# Altium project TemperatureController.PrjPcb (part 4 of 4)

## Sheet vioutchn7.SchDoc: VIOUTCHN1
size A4 portrait; Organization: 合肥弗雷电子; Address1: 玉兰大道14号D栋3楼; Address2: 肥西县桃花镇; Address3: 合肥市; Address4: 安徽省
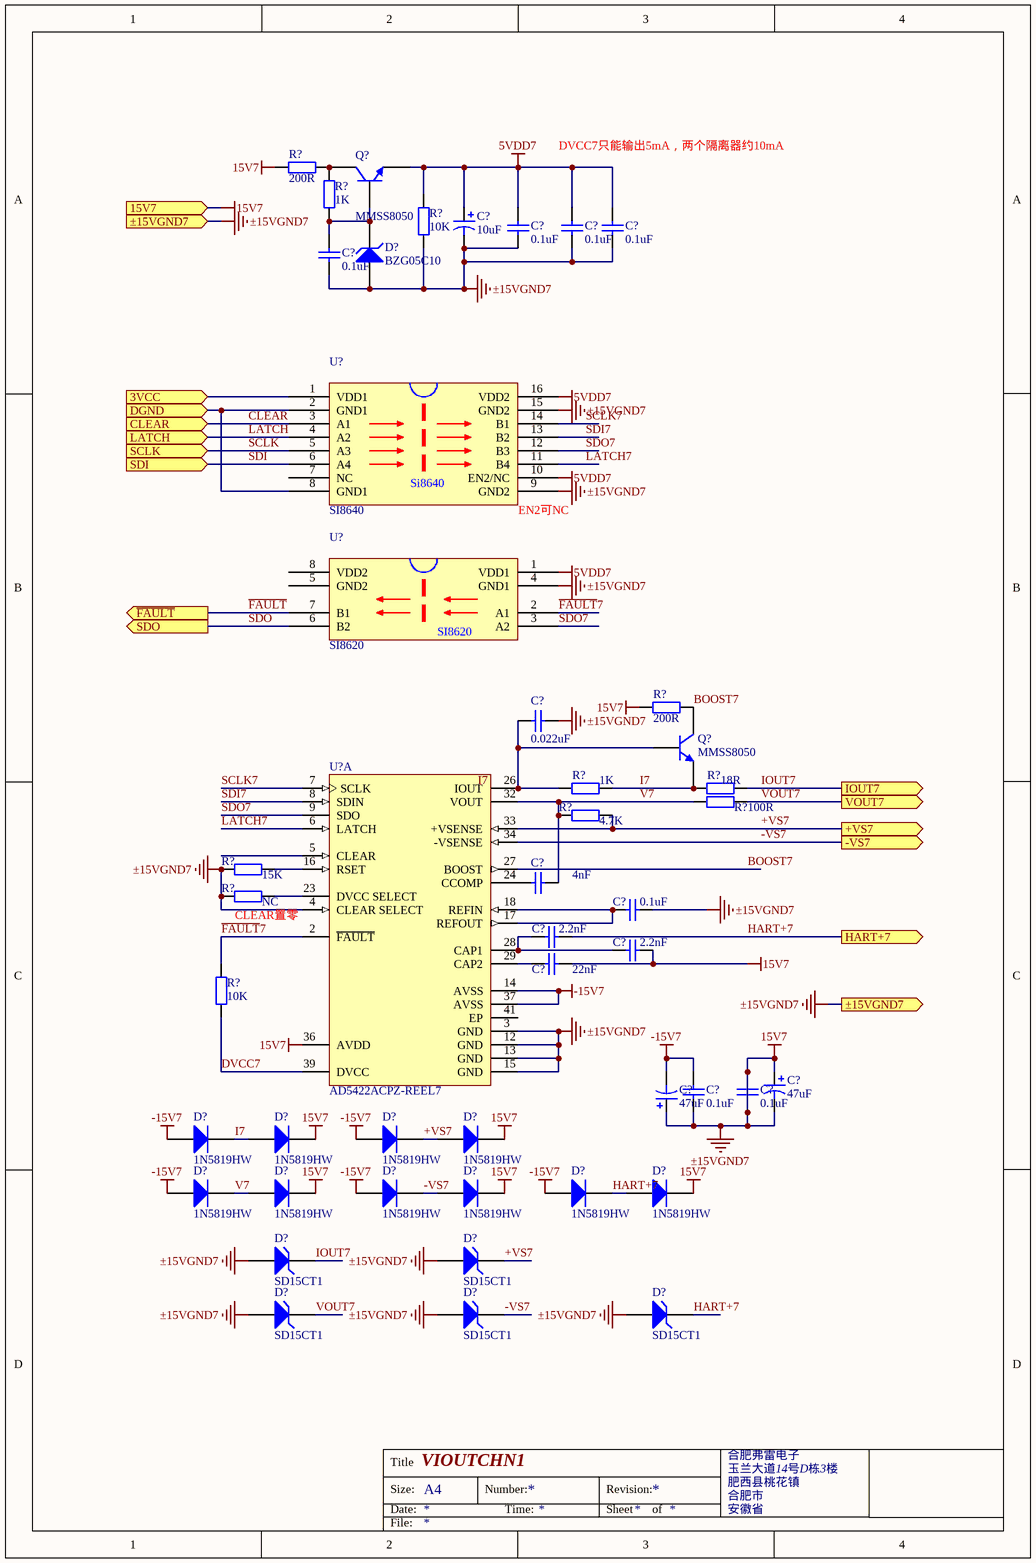
[diagram p13: vioutchn7.SchDoc]

### Parts
(Parts that share a designator on the sheet are numbered #1, #2 ... from top to bottom, then left to right.)
C?#131  value 10uF  [CB]  (hidden comment: T494B106M006AHAUTO)
C?#132  value 0.1uF  [0805c]  (hidden comment: CC0805MRX7R9BB104)
C?#133  value 0.1uF  [0805c]  (hidden comment: CC0805MRX7R9BB104)
C?#134  value 0.1uF  [0805c]  (hidden comment: CC0805MRX7R9BB104)
C?#135  value 0.1uF  [0805c]  (hidden comment: CC0805MRX7R9BB104)
C?#136  value 0.022uF  [0805c]  (hidden comment: CC0805MRX7R9BB103)
C?#137  value 4nF  [0805c]
C?#138  value 0.1uF  [0805c]  (hidden comment: CC0805MRX7R9BB104)
C?#139  value 2.2nF  [0805c]
C?#140  value 2.2nF  [0805c]
C?#141  value 22nF  [0805c]
C?#142  value 0.1uF  [0805c]  (hidden comment: CC0805MRX7R9BB104)
C?#143  value 0.1uF  [0805c]  (hidden comment: CC0805MRX7R9BB104)
C?#144  value 47uF  [CB]  (hidden comment: T494B476K025ATAUTO)
C?#145  value 47uF  [CB]  (hidden comment: T494B476K025ATAUTO)
D?#113  BZG05C10  [DO214]
D?#114  1N5819HW  [sod123]
D?#115  1N5819HW  [sod123]
D?#116  1N5819HW  [sod123]
D?#117  1N5819HW  [sod123]
D?#118  1N5819HW  [sod123]
D?#119  1N5819HW  [sod123]
D?#120  1N5819HW  [sod123]
D?#121  1N5819HW  [sod123]
D?#122  1N5819HW  [sod123]
D?#123  1N5819HW  [sod123]
D?#124  SD15CT1  [sod323]
D?#125  SD15CT1  [sod323]
D?#126  SD15CT1  [sod323]
D?#127  SD15CT1  [sod323]
D?#128  SD15CT1  [sod323]
Q?#15  MMSS8050  [SOT-23-BJT]
Q?#16  MMSS8050  [SOT-23-BJT]
R?#77  value 200R  [0805R]
R?#78  value 1K  [0805R]  (hidden comment: RC0805JR-071KL)
R?#79  value 10K  [0805R]  (hidden comment: RC0805JR-0710KL)
R?#80  value 200R  [0805R]
R?#81  value 1K  [0805R]  (hidden comment: RC0805JR-071KL)
R?#82  value 18R  [0805R]
R?#83  value 100R  [0805R]
R?#84  value 4.7K  [0805R]
R?#85  value 15K  [0805R]  (hidden comment: E192)
R?#86  value NC  [0805R]  (hidden comment: E192)
R?#87  value 10K  [0805R]  (hidden comment: RC0805JR-0710KL)
U?#33  SI8640
U?#34  SI8620
U?#35  AD5422ACPZ-REEL7  [CP-40-1_N]  (part A of 2)

### Ports
3VCC (in), 15V7 (in), +VS7 (out), -VS7 (out), CLEAR (in), DGND (in), HART+7 (out), IOUT7 (out), LATCH (in), SCLK (in), SDI (in), SDO (out), VOUT7 (out), ~{FAULT} (out), ±15VGND7 (in), ±15VGND7 (out)

### Nets
5VDD7: C?#131.1 C?#132.2 C?#133.2 C?#134.2 Q?#15.3(E) R?#79.1 U?#33.10(EN2/NC) U?#33.16(VDD2) U?#34.1(VDD1)
15V7: C?#131.2 C?#132.1 C?#133.1 C?#134.1 C?#135.2 C?#136.1 C?#138.2 C?#140.1 C?#141.1 C?#142.2 C?#143.1 C?#143.2 C?#144.1 C?#144.2 C?#145.1 D?#113.1(A) D?#115.2(K) D?#117.2(K) D?#119.2(K) D?#121.2(K) D?#123.2(K) D?#124.1(A) D?#125.1(A) D?#126.1(A) D?#127.1(A) D?#128.1(A) R?#77.2 R?#79.2 R?#80.2 R?#85.1 R?#86.1 U?#33.9(GND2) U?#33.15(GND2) U?#34.4(GND1) U?#35.3(GND) U?#35.4(CLEAR_SELECT) U?#35.12(GND) U?#35.13(GND) U?#35.15(GND) U?#35.36(AVDD) ; port 15V7, port ±15VGND7  [also labelled ±15VGND7]
-15V7: C?#142.1 C?#145.2 D?#114.1(A) D?#116.1(A) D?#118.1(A) D?#120.1(A) D?#122.1(A) U?#35.14(AVSS) U?#35.37(AVSS)
+VS7: D?#116.2(K) D?#117.1(A) D?#125.2(K) R?#84.2 U?#35.33(+VSENSE) ; port +VS7
-VS7: D?#120.2(K) D?#121.1(A) D?#127.2(K) U?#35.34(-VSENSE) ; port -VS7
BOOST7: Q?#16.1(C) R?#80.1 U?#35.27(BOOST)
CLEAR: U?#33.3(A1) ; port CLEAR
DVCC7: R?#87.2 U?#35.39(DVCC)
~{FAULT}: U?#34.7(B1) ; port ~{FAULT}
~{FAULT}7: R?#87.1 U?#34.2(A1) U?#35.2(~{FAULT})
HART+7: C?#139.1 D?#122.2(K) D?#123.1(A) D?#128.2(K) ; port HART+7
I7: D?#114.2(K) D?#115.1(A) Q?#16.3(E) R?#81.2 R?#82.1
IOUT7: D?#124.2(K) R?#82.2 ; port IOUT7
LATCH: U?#33.4(A2) ; port LATCH
LATCH7: U?#33.11(B4) U?#35.6(LATCH)
SCLK: U?#33.5(A3) ; port SCLK
SCLK7: U?#33.14(B1) U?#35.7(SCLK)
SDI: U?#33.6(A4) ; port SDI
SDI7: U?#33.13(B2) U?#35.8(SDIN)
SDO: U?#34.6(B2) ; port SDO
SDO7: U?#33.12(B3) U?#34.3(A2) U?#35.9(SDO)
V7: C?#137.2 D?#118.2(K) D?#119.1(A) R?#83.1 R?#84.1 U?#35.32(VOUT)
VOUT7: D?#126.2(K) R?#83.2 ; port VOUT7
NetC?#135_1: C?#135.1 D?#113.2(K) Q?#15.2(B) R?#78.1
NetC?#136_2: C?#136.2 Q?#16.2(B) R?#81.1 U?#35.26(IOUT)
NetC?#137_1: C?#137.1 U?#35.24(CCOMP)
NetC?#138_1: C?#138.1 U?#35.17(REFOUT) U?#35.18(REFIN)
NetC?#139_2: C?#139.2 C?#140.2 U?#35.28(CAP1)
NetC?#141_2: C?#141.2 U?#35.29(CAP2)
NetQ?#15_1: Q?#15.1(C) R?#77.1 R?#78.2
NetR?#85_2: R?#85.2 U?#35.16(RSET)
NetR?#86_2: R?#86.2 U?#35.23(DVCC_SELECT)
NetU?#33_1: U?#33.1(VDD1) ; port 3VCC
NetU?#33_2: U?#33.2(GND1) U?#33.8(GND1) ; port DGND

Not connected (* = marked no-connect by the designer): U?#33 7(NC); U?#34 5(GND2) 8(VDD2); U?#35 5(CLEAR) 41(EP)

### Notes on the sheet
- DVCC7只能输出5mA，两个隔离器约10mA
- (near U?#33) EN2可NC
- (near R?#86) CLEAR置零
- Labels drawn without touching a wire or pin: I7
- Title
- Size:
- Date:
- A4
- Number:
- Time:
- Revision:
- Sheet
- of
- File:
- (in symbol SI8640) Si8640

### Library data of the parts
C?#131 C?#144 C?#145 = Cap Pol1: Polarized Capacitor (Radial); Published: 8-Jun-2000; LatestRevisionDate: 17-Jul-2002; LatestRevisionNote: Re-released for DXP Platform.; PackageReference: RB7.6-15; Publisher: Altium Limited; PackageDescription: Polarized Capacitor (Radial); 2 Leads
C?#132-C?#143 = Cap: Capacitor; Published: 8-Jun-2000; LatestRevisionDate: 17-Jul-2002; LatestRevisionNote: Re-released for DXP Platform.; PackageReference: RAD-0.3; Publisher: Altium Limited; PackageDescription: Radial Cap, Thru-Hole; 2 Leads; 0.3 in Pin Spacing
D?#113 = BZG05C10: Silicon Zener Diode (3W); Published: 8-Jun-2000; LatestRevisionDate: 17-Jul-2002; LatestRevisionNote: Re-released for DXP Platform.; DatasheetDocument: 1-Apr-1999; PackageDocument: Apr-1999; PackageReference: DO214; Publisher: Altium Limited; ComponentLink1Description: Manufacturer Link; ComponentLink1URL: http://www.vishay.com/; ComponentLink2Description: Datasheet; ComponentLink2URL: http://www.vishay.com/docs/85595/85595.pdf
D?#114-D?#123 = Diode: Default Diode; Published: 8-Jun-2000; LatestRevisionDate: 17-Jul-2002; LatestRevisionNote: Re-released for DXP Platform.; PackageVersion: Sep-1996; PackageReference: SMC; Publisher: Altium Limited; PackageDescription: DO-214-AB/SMC; 2 C-Bend Leads; Body 7.9 x 5.9 mm, inc. leads (LxW); Code_JEDEC: DO-214-AB
D?#124-D?#128 = D Zener: Zener Diode; Published: 8-Jun-2000; LatestRevisionDate: 17-Jul-2002; LatestRevisionNote: Re-released for DXP Platform.; PackageReference: DIODE-0.7; Publisher: Altium Limited; PackageDescription: Diode, Thru-Hole; 2 Leads; 0.7 in Pin Spacing
Q?#15 Q?#16 = NPN: NPN Bipolar Transistor; Published: 8-Jun-2000; LatestRevisionDate: 17-Jul-2002; LatestRevisionNote: Re-released for DXP Platform.; PackageReference: TO-226-AA; Publisher: Altium Limited; PackageDescription: TO, Flat Index; 3 In-Line, Axial Leads; Body Dia. 4.8mm; Leads 0.55 x 0.51 mm (max); Code_JEDEC: TO-226-AA
R?#77-R?#87 = Res2: Resistor; Published: 8-Jun-2000; LatestRevisionDate: 17-Jul-2002; LatestRevisionNote: Re-released for DXP Platform.; PackageReference: AXIAL-0.4; Publisher: Altium Limited; PackageDescription: Axial Device, Thru-Hole; 2 Leads; 0.4 in Pin Spacing
U?#35 = AD5422ACPZ-REEL7: as U?#14 on sheet viout; DatasheetVersion: Rev.E; PackageVersion: Oct-2006; PackageReference: CP-40-1; PackageDescription: 40-Pin Lead Frame Chip Scale Package [LFCSP_VQ] Very Thin Quad; Supplier 1: Digi-Key; Supplier Part Number 1: AD5422ACPZ-REEL7TR-ND; Supplier 2: Digi-Key; Supplier Part Number 2: AD5422ACPZ-REEL7CT-ND; Supplier 3: Digi-Key; Supplier Part Number 3: AD5422ACPZ-REEL7DKR-ND; Supplier 4: Mouser; Supplier Part Number 4: 584-AD5422ACPZ-R7; Packing: Reel; RoHS: Y; Mounting Technology: Surface Mount; Code_JEDEC: MO-220-VJJD-2; PartNumber: AD5422ACPZ-REEL7; ComponentLink1Description: Manufacturer URL; ComponentLink1URL: http://www.analog.com/en/index.html; ComponentLink2Description: Datasheet; ComponentLink2URL: http://www.analog.com/static/imported-files/data_sheets/AD5412_5422.pdf; ComponentLink3Description: Package Specification; ComponentLink3URL: http://www.analog.com/static/imported-files/packages/PKG_PDF/LFCSP(CP)/CP_40_1.pdf; ComponentLink4Description: Product URL; ComponentLink4URL: http://www.analog.com/en/digital-to-analog-converters/da-converters/ad5422/products/product.html; ComponentLink5Description: Reference Design URL; ComponentLink5URL: http://www.analog.com/en/digital-to-analog-converters/da-converters/ad5422/products/product.html#prod_cross_sell

## Sheet vioutchn8.SchDoc: VIOUTCHN8
size A4 portrait; Organization: 合肥弗雷电子; Address1: 玉兰大道14号D栋3楼; Address2: 肥西县桃花镇; Address3: 合肥市; Address4: 安徽省
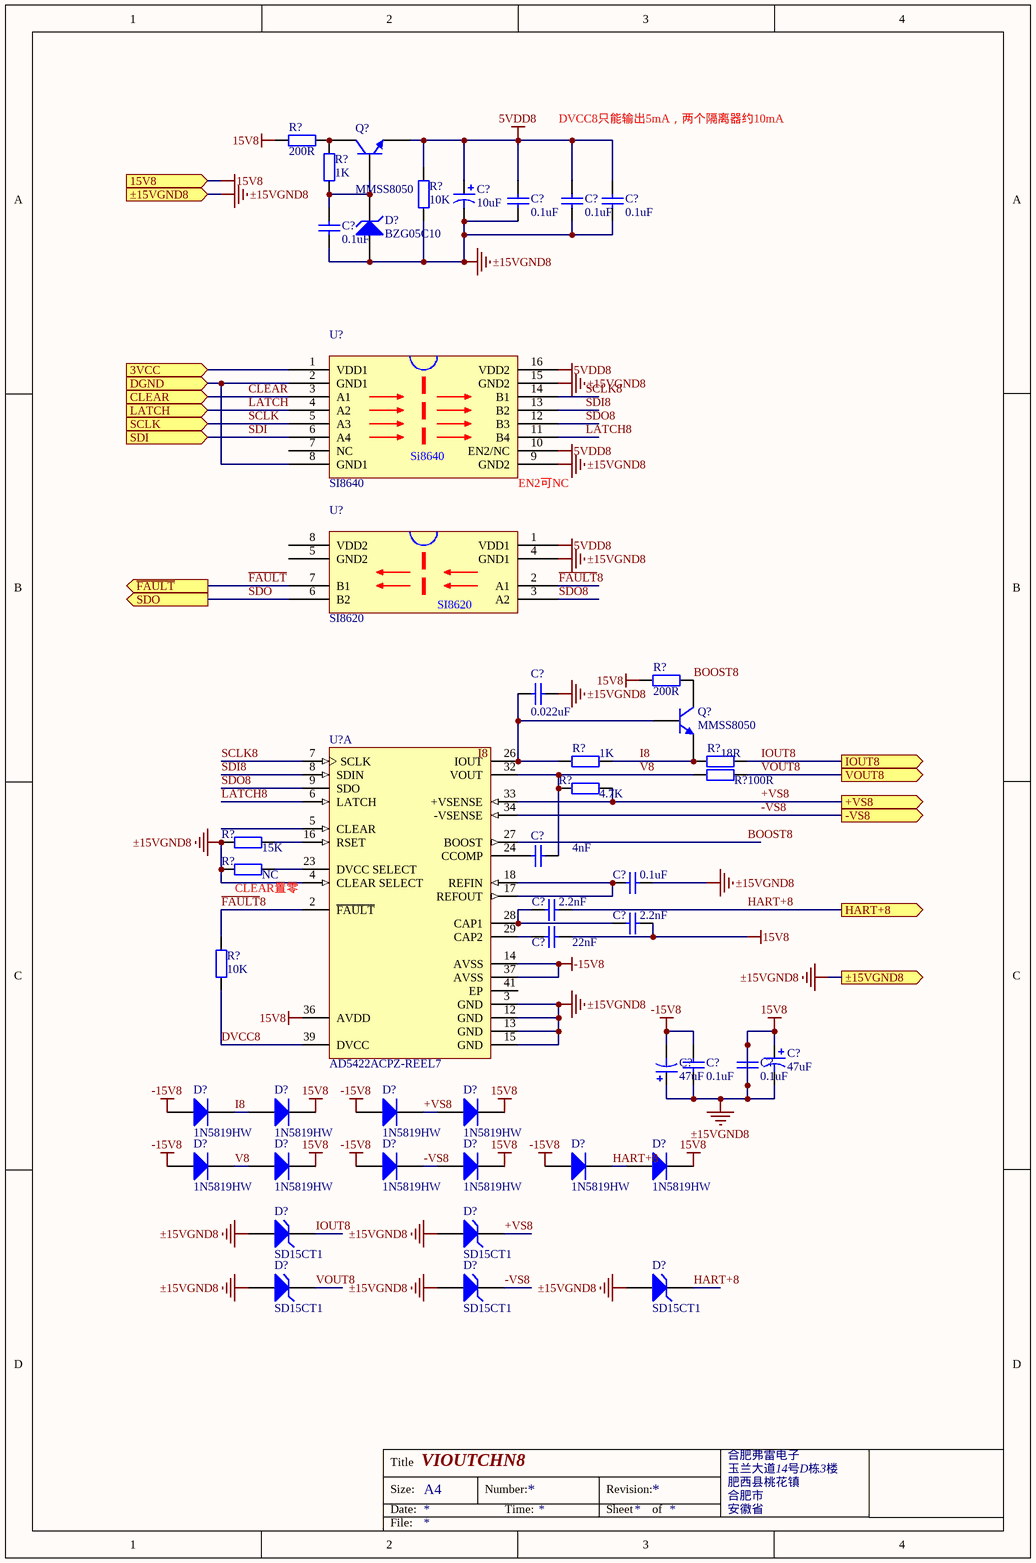
[diagram p14: vioutchn8.SchDoc]

### Parts
(Parts that share a designator on the sheet are numbered #1, #2 ... from top to bottom, then left to right.)
C?#146  value 10uF  [CB]  (hidden comment: T494B106M006AHAUTO)
C?#147  value 0.1uF  [0805c]  (hidden comment: CC0805MRX7R9BB104)
C?#148  value 0.1uF  [0805c]  (hidden comment: CC0805MRX7R9BB104)
C?#149  value 0.1uF  [0805c]  (hidden comment: CC0805MRX7R9BB104)
C?#150  value 0.1uF  [0805c]  (hidden comment: CC0805MRX7R9BB104)
C?#151  value 0.022uF  [0805c]  (hidden comment: CC0805MRX7R9BB103)
C?#152  value 4nF  [0805c]
C?#153  value 0.1uF  [0805c]  (hidden comment: CC0805MRX7R9BB104)
C?#154  value 2.2nF  [0805c]
C?#155  value 2.2nF  [0805c]
C?#156  value 22nF  [0805c]
C?#157  value 0.1uF  [0805c]  (hidden comment: CC0805MRX7R9BB104)
C?#158  value 0.1uF  [0805c]  (hidden comment: CC0805MRX7R9BB104)
C?#159  value 47uF  [CB]  (hidden comment: T494B476K025ATAUTO)
C?#160  value 47uF  [CB]  (hidden comment: T494B476K025ATAUTO)
D?#129  BZG05C10  [DO214]
D?#130  1N5819HW  [sod123]
D?#131  1N5819HW  [sod123]
D?#132  1N5819HW  [sod123]
D?#133  1N5819HW  [sod123]
D?#134  1N5819HW  [sod123]
D?#135  1N5819HW  [sod123]
D?#136  1N5819HW  [sod123]
D?#137  1N5819HW  [sod123]
D?#138  1N5819HW  [sod123]
D?#139  1N5819HW  [sod123]
D?#140  SD15CT1  [sod323]
D?#141  SD15CT1  [sod323]
D?#142  SD15CT1  [sod323]
D?#143  SD15CT1  [sod323]
D?#144  SD15CT1  [sod323]
Q?#17  MMSS8050  [SOT-23-BJT]
Q?#18  MMSS8050  [SOT-23-BJT]
R?#88  value 200R  [0805R]
R?#89  value 1K  [0805R]  (hidden comment: RC0805JR-071KL)
R?#90  value 10K  [0805R]  (hidden comment: RC0805JR-0710KL)
R?#91  value 200R  [0805R]
R?#92  value 1K  [0805R]  (hidden comment: RC0805JR-071KL)
R?#93  value 18R  [0805R]
R?#94  value 100R  [0805R]
R?#95  value 4.7K  [0805R]
R?#96  value 15K  [0805R]  (hidden comment: E192)
R?#97  value NC  [0805R]  (hidden comment: E192)
R?#98  value 10K  [0805R]  (hidden comment: RC0805JR-0710KL)
U?#36  SI8640
U?#37  SI8620
U?#38  AD5422ACPZ-REEL7  [CP-40-1_N]  (part A of 2)

### Ports
3VCC (in), 15V8 (in), +VS8 (out), -VS8 (out), CLEAR (in), DGND (in), HART+8 (out), IOUT8 (out), LATCH (in), SCLK (in), SDI (in), SDO (out), VOUT8 (out), ~{FAULT} (out), ±15VGND8 (in), ±15VGND8 (out)

### Nets
5VDD8: C?#146.1 C?#147.2 C?#148.2 C?#149.2 Q?#17.3(E) R?#90.1 U?#36.10(EN2/NC) U?#36.16(VDD2) U?#37.1(VDD1)
15V8: C?#146.2 C?#147.1 C?#148.1 C?#149.1 C?#150.2 C?#151.1 C?#153.2 C?#155.1 C?#156.1 C?#157.2 C?#158.1 C?#158.2 C?#159.1 C?#159.2 C?#160.1 D?#129.1(A) D?#131.2(K) D?#133.2(K) D?#135.2(K) D?#137.2(K) D?#139.2(K) D?#140.1(A) D?#141.1(A) D?#142.1(A) D?#143.1(A) D?#144.1(A) R?#88.2 R?#90.2 R?#91.2 R?#96.1 R?#97.1 U?#36.9(GND2) U?#36.15(GND2) U?#37.4(GND1) U?#38.3(GND) U?#38.4(CLEAR_SELECT) U?#38.12(GND) U?#38.13(GND) U?#38.15(GND) U?#38.36(AVDD) ; port 15V8, port ±15VGND8  [also labelled ±15VGND8]
-15V8: C?#157.1 C?#160.2 D?#130.1(A) D?#132.1(A) D?#134.1(A) D?#136.1(A) D?#138.1(A) U?#38.14(AVSS) U?#38.37(AVSS)
+VS8: D?#132.2(K) D?#133.1(A) D?#141.2(K) R?#95.2 U?#38.33(+VSENSE) ; port +VS8
-VS8: D?#136.2(K) D?#137.1(A) D?#143.2(K) U?#38.34(-VSENSE) ; port -VS8
BOOST8: Q?#18.1(C) R?#91.1 U?#38.27(BOOST)
CLEAR: U?#36.3(A1) ; port CLEAR
DVCC8: R?#98.2 U?#38.39(DVCC)
~{FAULT}: U?#37.7(B1) ; port ~{FAULT}
~{FAULT}8: R?#98.1 U?#37.2(A1) U?#38.2(~{FAULT})
HART+8: C?#154.1 D?#138.2(K) D?#139.1(A) D?#144.2(K) ; port HART+8
I8: D?#130.2(K) D?#131.1(A) Q?#18.3(E) R?#92.2 R?#93.1
IOUT8: D?#140.2(K) R?#93.2 ; port IOUT8
LATCH: U?#36.4(A2) ; port LATCH
LATCH8: U?#36.11(B4) U?#38.6(LATCH)
SCLK: U?#36.5(A3) ; port SCLK
SCLK8: U?#36.14(B1) U?#38.7(SCLK)
SDI: U?#36.6(A4) ; port SDI
SDI8: U?#36.13(B2) U?#38.8(SDIN)
SDO: U?#37.6(B2) ; port SDO
SDO8: U?#36.12(B3) U?#37.3(A2) U?#38.9(SDO)
V8: C?#152.2 D?#134.2(K) D?#135.1(A) R?#94.1 R?#95.1 U?#38.32(VOUT)
VOUT8: D?#142.2(K) R?#94.2 ; port VOUT8
NetC?#150_1: C?#150.1 D?#129.2(K) Q?#17.2(B) R?#89.1
NetC?#151_2: C?#151.2 Q?#18.2(B) R?#92.1 U?#38.26(IOUT)
NetC?#152_1: C?#152.1 U?#38.24(CCOMP)
NetC?#153_1: C?#153.1 U?#38.17(REFOUT) U?#38.18(REFIN)
NetC?#154_2: C?#154.2 C?#155.2 U?#38.28(CAP1)
NetC?#156_2: C?#156.2 U?#38.29(CAP2)
NetQ?#17_1: Q?#17.1(C) R?#88.1 R?#89.2
NetR?#96_2: R?#96.2 U?#38.16(RSET)
NetR?#97_2: R?#97.2 U?#38.23(DVCC_SELECT)
NetU?#36_1: U?#36.1(VDD1) ; port 3VCC
NetU?#36_2: U?#36.2(GND1) U?#36.8(GND1) ; port DGND

Not connected (* = marked no-connect by the designer): U?#36 7(NC); U?#37 5(GND2) 8(VDD2); U?#38 5(CLEAR) 41(EP)

### Notes on the sheet
- DVCC8只能输出5mA，两个隔离器约10mA
- (near U?#36) EN2可NC
- (near R?#97) CLEAR置零
- Labels drawn without touching a wire or pin: I8
- Title
- Size:
- Date:
- A4
- Number:
- Time:
- Revision:
- Sheet
- of
- File:
- (in symbol SI8640) Si8640

### Library data of the parts
C?#146 C?#159 C?#160 = Cap Pol1: Polarized Capacitor (Radial); Published: 8-Jun-2000; LatestRevisionDate: 17-Jul-2002; LatestRevisionNote: Re-released for DXP Platform.; PackageReference: RB7.6-15; Publisher: Altium Limited; PackageDescription: Polarized Capacitor (Radial); 2 Leads
C?#147-C?#158 = Cap: Capacitor; Published: 8-Jun-2000; LatestRevisionDate: 17-Jul-2002; LatestRevisionNote: Re-released for DXP Platform.; PackageReference: RAD-0.3; Publisher: Altium Limited; PackageDescription: Radial Cap, Thru-Hole; 2 Leads; 0.3 in Pin Spacing
D?#129 = BZG05C10: Silicon Zener Diode (3W); Published: 8-Jun-2000; LatestRevisionDate: 17-Jul-2002; LatestRevisionNote: Re-released for DXP Platform.; DatasheetDocument: 1-Apr-1999; PackageDocument: Apr-1999; PackageReference: DO214; Publisher: Altium Limited; ComponentLink1Description: Manufacturer Link; ComponentLink1URL: http://www.vishay.com/; ComponentLink2Description: Datasheet; ComponentLink2URL: http://www.vishay.com/docs/85595/85595.pdf
D?#130-D?#139 = Diode: Default Diode; Published: 8-Jun-2000; LatestRevisionDate: 17-Jul-2002; LatestRevisionNote: Re-released for DXP Platform.; PackageVersion: Sep-1996; PackageReference: SMC; Publisher: Altium Limited; PackageDescription: DO-214-AB/SMC; 2 C-Bend Leads; Body 7.9 x 5.9 mm, inc. leads (LxW); Code_JEDEC: DO-214-AB
D?#140-D?#144 = D Zener: Zener Diode; Published: 8-Jun-2000; LatestRevisionDate: 17-Jul-2002; LatestRevisionNote: Re-released for DXP Platform.; PackageReference: DIODE-0.7; Publisher: Altium Limited; PackageDescription: Diode, Thru-Hole; 2 Leads; 0.7 in Pin Spacing
Q?#17 Q?#18 = NPN: NPN Bipolar Transistor; Published: 8-Jun-2000; LatestRevisionDate: 17-Jul-2002; LatestRevisionNote: Re-released for DXP Platform.; PackageReference: TO-226-AA; Publisher: Altium Limited; PackageDescription: TO, Flat Index; 3 In-Line, Axial Leads; Body Dia. 4.8mm; Leads 0.55 x 0.51 mm (max); Code_JEDEC: TO-226-AA
R?#88-R?#98 = Res2: Resistor; Published: 8-Jun-2000; LatestRevisionDate: 17-Jul-2002; LatestRevisionNote: Re-released for DXP Platform.; PackageReference: AXIAL-0.4; Publisher: Altium Limited; PackageDescription: Axial Device, Thru-Hole; 2 Leads; 0.4 in Pin Spacing
U?#38 = AD5422ACPZ-REEL7: Single 16-Bit Current Source Digital-to-Analog Converter with Serial Interface and HART Connectivity, -40 to +85 degC, CP-40-1, Pb-Free, Reel; Generic Part Number: AD5422; Manufacturer: Analog Devices; # DAC Outputs: 1; Max V+: 40V; Op Pwr Diss: 158mW; Resolution (Bits): 16; Settling Time: 18祍; Single Supply: No; DatasheetVersion: Rev.E; PackageVersion: Oct-2006; PackageReference: CP-40-1; PackageDescription: 40-Pin Lead Frame Chip Scale Package [LFCSP_VQ] Very Thin Quad; Supplier 1: Digi-Key; Supplier Part Number 1: AD5422ACPZ-REEL7TR-ND; Supplier 2: Digi-Key; Supplier Part Number 2: AD5422ACPZ-REEL7CT-ND; Supplier 3: Digi-Key; Supplier Part Number 3: AD5422ACPZ-REEL7DKR-ND; Supplier 4: Mouser; Supplier Part Number 4: 584-AD5422ACPZ-R7; Packing: Reel; RoHS: Y; Mounting Technology: Surface Mount; Code_JEDEC: MO-220-VJJD-2; PartNumber: AD5422ACPZ-REEL7; ComponentLink1Description: Manufacturer URL; ComponentLink1URL: http://www.analog.com/en/index.html; ComponentLink2Description: Datasheet; ComponentLink2URL: http://www.analog.com/static/imported-files/data_sheets/AD5412_5422.pdf; ComponentLink3Description: Package Specification; ComponentLink3URL: http://www.analog.com/static/imported-files/packages/PKG_PDF/LFCSP(CP)/CP_40_1.pdf; ComponentLink4Description: Product URL; ComponentLink4URL: http://www.analog.com/en/digital-to-analog-converters/da-converters/ad5422/products/product.html; ComponentLink5Description: Reference Design URL; ComponentLink5URL: http://www.analog.com/en/digital-to-analog-converters/da-converters/ad5422/products/product.html#prod_cross_sell

## Sheet power.SchDoc
size A3; Organization: 合肥弗雷电子; Address1: 玉兰达到14号D栋3楼; Address2: 肥西县桃花镇; Address3: 合肥市; Address4: 安徽省
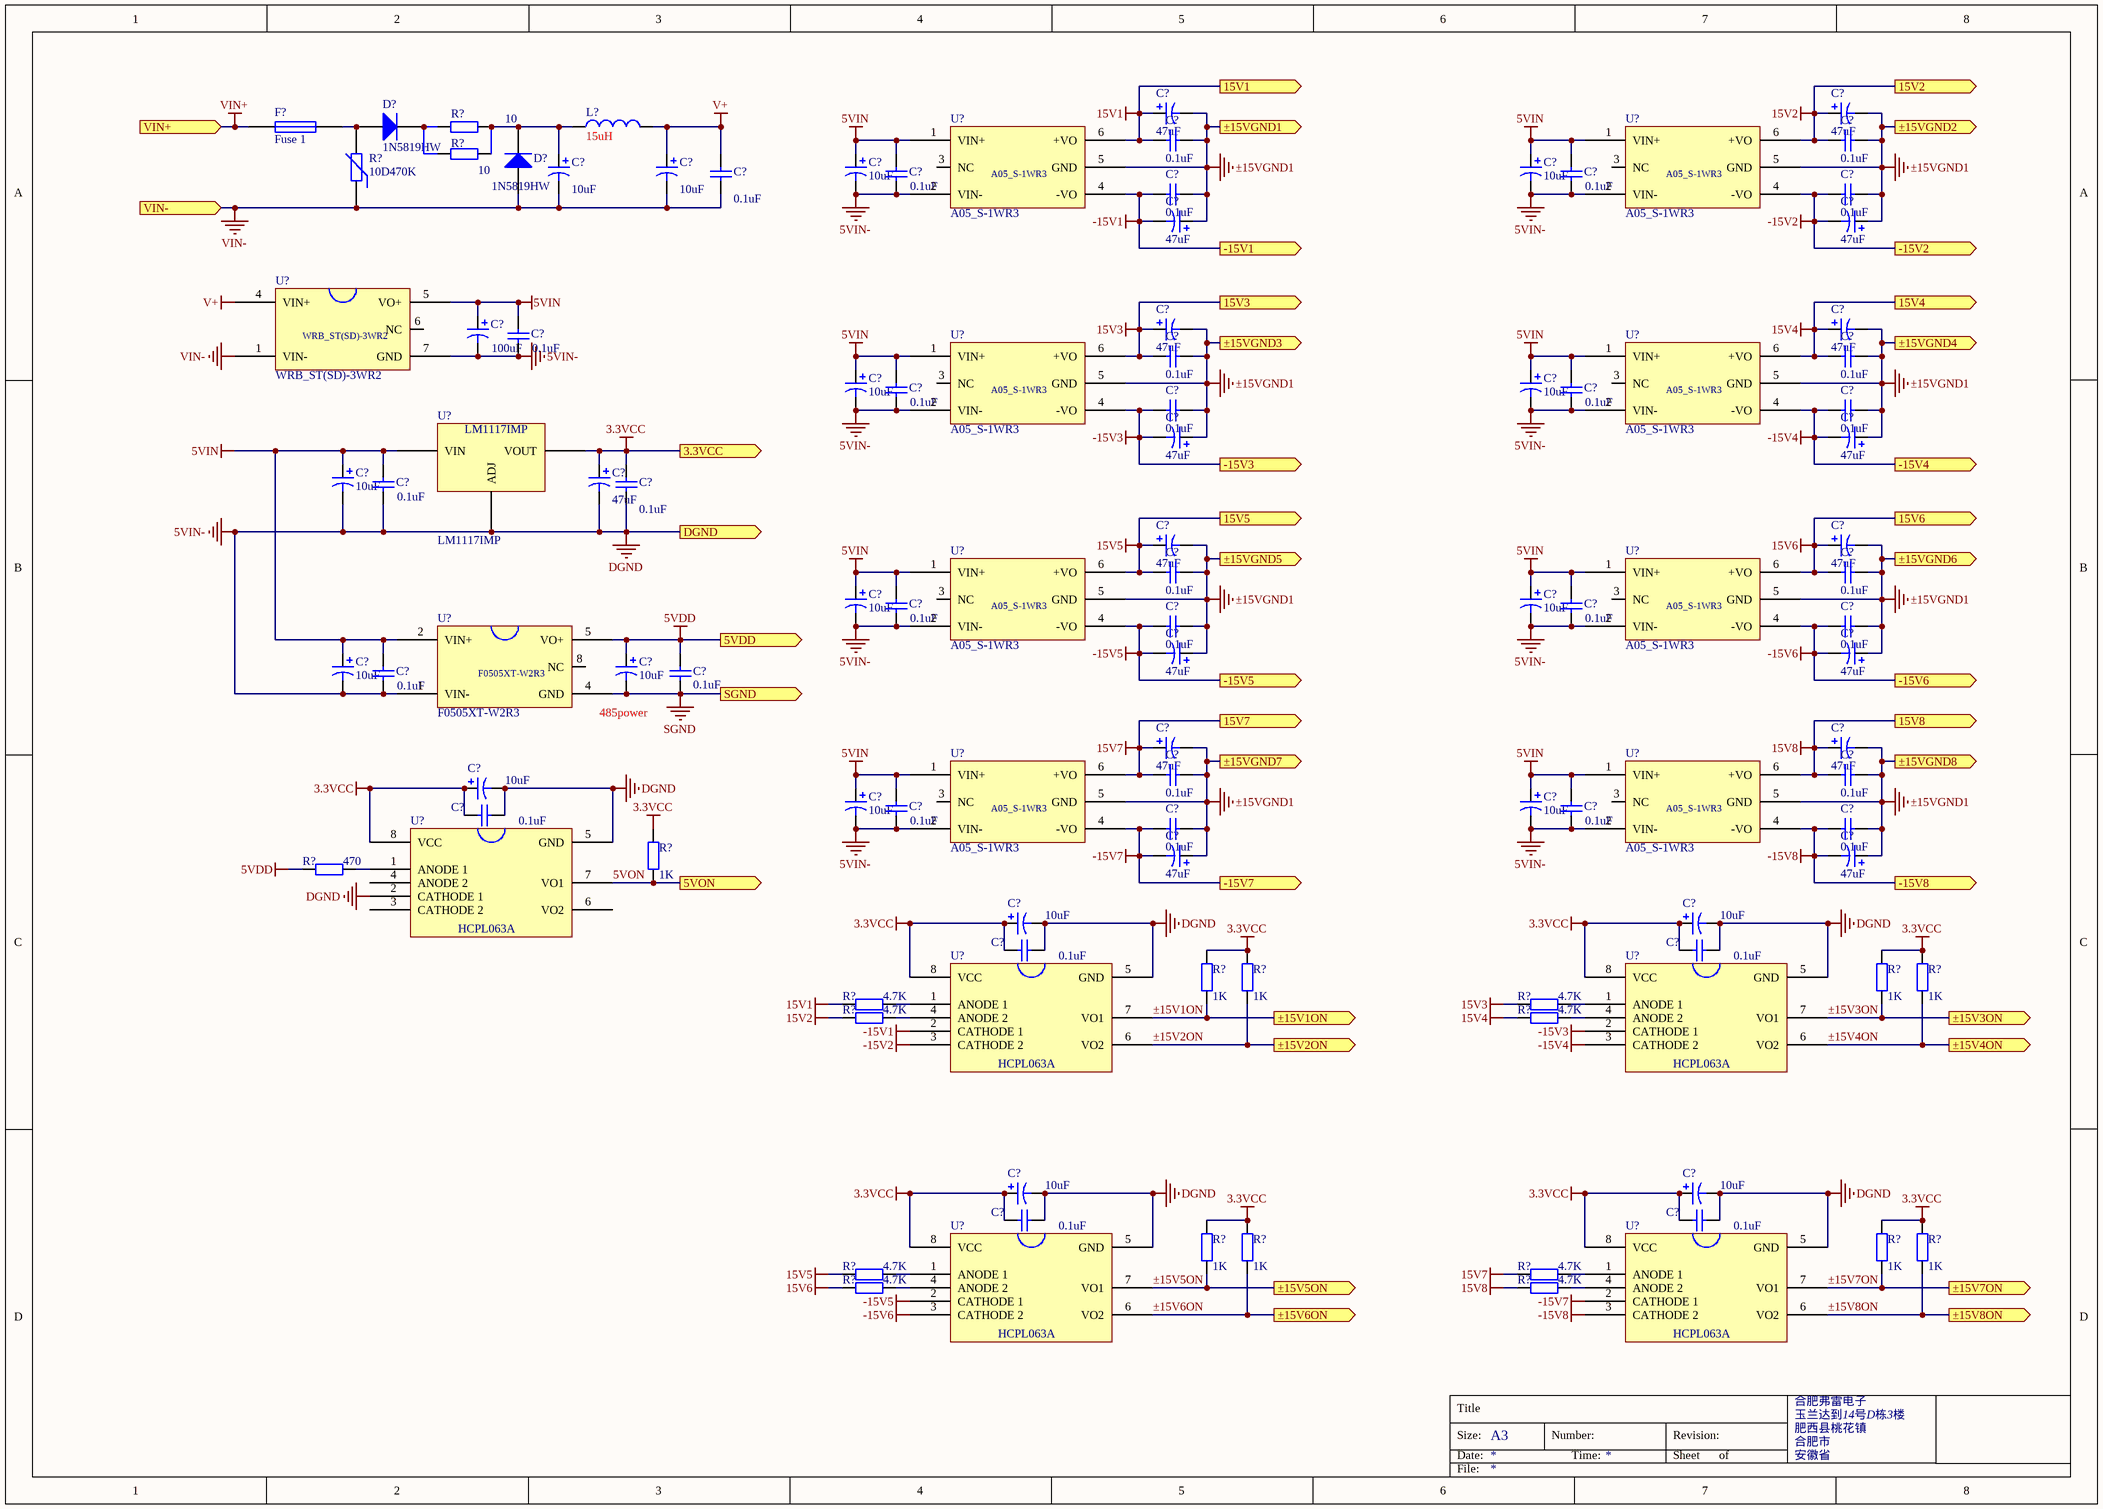
[diagram p15: power.SchDoc]

### Parts
(Parts that share a designator on the sheet are numbered #1, #2 ... from top to bottom, then left to right.)
C?#161  value 47uF  [CB]  (hidden comment: T494B476K025ATAUTO)
C?#162  value 47uF  [CB]  (hidden comment: T494B476K025ATAUTO)
C?#163  value 0.1uF  [0805c]  (hidden comment: CC0805MRX7R9BB104)
C?#164  value 0.1uF  [0805c]  (hidden comment: CC0805MRX7R9BB104)
C?#165  value 10uF  [Φ6.3×11.5]  (hidden comment: ECR1HQG100M-063007)
C?#166  value 10uF  [Φ6.3×11.5]  (hidden comment: ECR1HQG100M-063007)
C?#167  value 0.1uF  [0805c]  (hidden comment: CC0805MRX7R9BB104)
C?#168  value 10uF  [CB]  (hidden comment: T494B106M006AHAUTO)
C?#169  value 10uF  [CB]  (hidden comment: T494B106M006AHAUTO)
C?#170  value 0.1uF  [0805c]  (hidden comment: CC0805MRX7R9BB104)
C?#171  value 0.1uF  [0805c]  (hidden comment: CC0805MRX7R9BB104)
C?#172  value 0.1uF  [0805c]  (hidden comment: CC0805MRX7R9BB104)
C?#173  value 0.1uF  [0805c]  (hidden comment: CC0805MRX7R9BB104)
C?#174  value 47uF  [CB]  (hidden comment: T494B476K025ATAUTO)
C?#175  value 47uF  [CB]  (hidden comment: T494B476K025ATAUTO)
C?#176  value 47uF  [CB]  (hidden comment: T494B476K025ATAUTO)
C?#177  value 47uF  [CB]  (hidden comment: T494B476K025ATAUTO)
C?#178  value 100uF  [CB]  (hidden comment: T494B107M006AHAUTO)
C?#179  value 0.1uF  [0805c]  (hidden comment: CC0805MRX7R9BB104)
C?#180  value 0.1uF  [0805c]  (hidden comment: CC0805MRX7R9BB104)
C?#181  value 0.1uF  [0805c]  (hidden comment: CC0805MRX7R9BB104)
C?#182  value 10uF  [CB]  (hidden comment: T494B106M006AHAUTO)
C?#183  value 10uF  [CB]  (hidden comment: T494B106M006AHAUTO)
C?#184  value 0.1uF  [0805c]  (hidden comment: CC0805MRX7R9BB104)
C?#185  value 0.1uF  [0805c]  (hidden comment: CC0805MRX7R9BB104)
C?#186  value 0.1uF  [0805c]  (hidden comment: CC0805MRX7R9BB104)
C?#187  value 0.1uF  [0805c]  (hidden comment: CC0805MRX7R9BB104)
C?#188  value 47uF  [CB]  (hidden comment: T494B476K025ATAUTO)
C?#189  value 47uF  [CB]  (hidden comment: T494B476K025ATAUTO)
C?#190  value 10uF  [CB]  (hidden comment: T494B106M006AHAUTO)
C?#191  value 47uF  [CB]  (hidden comment: T494B476M010AHAUTO)
C?#192  value 0.1uF  [0805c]  (hidden comment: CC0805MRX7R9BB104)
C?#193  value 0.1uF  [0805c]  (hidden comment: CC0805MRX7R9BB104)
C?#194  value 47uF  [CB]  (hidden comment: T494B476K025ATAUTO)
C?#195  value 47uF  [CB]  (hidden comment: T494B476K025ATAUTO)
C?#196  value 0.1uF  [0805c]  (hidden comment: CC0805MRX7R9BB104)
C?#197  value 0.1uF  [0805c]  (hidden comment: CC0805MRX7R9BB104)
C?#198  value 10uF  [CB]  (hidden comment: T494B106M006AHAUTO)
C?#199  value 10uF  [CB]  (hidden comment: T494B106M006AHAUTO)
C?#200  value 0.1uF  [0805c]  (hidden comment: CC0805MRX7R9BB104)
C?#201  value 0.1uF  [0805c]  (hidden comment: CC0805MRX7R9BB104)
C?#202  value 0.1uF  [0805c]  (hidden comment: CC0805MRX7R9BB104)
C?#203  value 0.1uF  [0805c]  (hidden comment: CC0805MRX7R9BB104)
C?#204  value 10uF  [CB]  (hidden comment: T494B106M006AHAUTO)
C?#205  value 10uF  [CB]  (hidden comment: T494B106M006AHAUTO)
C?#206  value 47uF  [CB]  (hidden comment: T494B476K025ATAUTO)
C?#207  value 47uF  [CB]  (hidden comment: T494B476K025ATAUTO)
C?#208  value 0.1uF  [0805c]  (hidden comment: CC0805MRX7R9BB104)
C?#209  value 0.1uF  [0805c]  (hidden comment: CC0805MRX7R9BB104)
C?#210  value 47uF  [CB]  (hidden comment: T494B476K025ATAUTO)
C?#211  value 47uF  [CB]  (hidden comment: T494B476K025ATAUTO)
C?#212  value 0.1uF  [0805c]  (hidden comment: CC0805MRX7R9BB104)
C?#213  value 0.1uF  [0805c]  (hidden comment: CC0805MRX7R9BB104)
C?#214  value 10uF  [CB]  (hidden comment: T494B106M006AHAUTO)
C?#215  value 0.1uF  [0805c]  (hidden comment: CC0805MRX7R9BB104)
C?#216  value 10uF  [CB]  (hidden comment: T494B106M006AHAUTO)
C?#217  value 10uF  [CB]  (hidden comment: T494B106M006AHAUTO)
C?#218  value 0.1uF  [0805c]  (hidden comment: CC0805MRX7R9BB104)
C?#219  value 0.1uF  [0805c]  (hidden comment: CC0805MRX7R9BB104)
C?#220  value 0.1uF  [0805c]  (hidden comment: CC0805MRX7R9BB104)
C?#221  value 0.1uF  [0805c]  (hidden comment: CC0805MRX7R9BB104)
C?#222  value 47uF  [CB]  (hidden comment: T494B476K025ATAUTO)
C?#223  value 47uF  [CB]  (hidden comment: T494B476K025ATAUTO)
C?#224  value 10uF  [CB]  (hidden comment: T494B106M006AHAUTO)
C?#225  value 10uF  [CB]  (hidden comment: T494B106M006AHAUTO)
C?#226  value 0.1uF  [0805c]  (hidden comment: CC0805MRX7R9BB104)
C?#227  value 0.1uF  [0805c]  (hidden comment: CC0805MRX7R9BB104)
C?#228  value 10uF  [CB]  (hidden comment: T494B106M006AHAUTO)
C?#229  value 10uF  [CB]  (hidden comment: T494B106M006AHAUTO)
C?#230  value 0.1uF  [0805c]  (hidden comment: CC0805MRX7R9BB104)
C?#231  value 0.1uF  [0805c]  (hidden comment: CC0805MRX7R9BB104)
D?#145  1N5819HW  [sod123]
D?#146  1N5819HW  [sod123]
F?  Fuse 1  [0805r]
L?  value 15uH  [vls4012]  (hidden comment: VLS4012HBX-150M)
R?#99  value 10  [0805R]  (hidden comment: PNP-200KJBJ26-10R)
R?#100  value 10  [0805R]  (hidden comment: PNP-200KJBJ26-10R)
R?#101  10D470K  [mov]
R?#102  value 1K  [0805R]  (hidden comment: RC0805JR-071KL)
R?#103  value 470  [0805R]  (hidden comment: RC0805JR-07470RL)
R?#104  value 1K  [0805R]  (hidden comment: RC0805JR-071KL)
R?#105  value 1K  [0805R]  (hidden comment: RC0805JR-071KL)
R?#106  value 1K  [0805R]  (hidden comment: RC0805JR-071KL)
R?#107  value 1K  [0805R]  (hidden comment: RC0805JR-071KL)
R?#108  value 4.7K  [0805R]  (hidden comment: RC0805JR-074700RL)
R?#109  value 4.7K  [0805R]  (hidden comment: RC0805JR-074700RL)
R?#110  value 4.7K  [0805R]  (hidden comment: RC0805JR-074700RL)
R?#111  value 4.7K  [0805R]  (hidden comment: RC0805JR-074700RL)
R?#112  value 1K  [0805R]  (hidden comment: RC0805JR-071KL)
R?#113  value 1K  [0805R]  (hidden comment: RC0805JR-071KL)
R?#114  value 1K  [0805R]  (hidden comment: RC0805JR-071KL)
R?#115  value 1K  [0805R]  (hidden comment: RC0805JR-071KL)
R?#116  value 4.7K  [0805R]  (hidden comment: RC0805JR-074700RL)
R?#117  value 4.7K  [0805R]  (hidden comment: RC0805JR-074700RL)
R?#118  value 4.7K  [0805R]  (hidden comment: RC0805JR-074700RL)
R?#119  value 4.7K  [0805R]  (hidden comment: RC0805JR-074700RL)
U?#39  A05_S-1WR3  [A05_S-1WR3]
U?#40  A05_S-1WR3  [A05_S-1WR3]
U?#41  WRB_ST(SD)-3WR2  [WRB_ST(SD)-3WR2]
U?#42  A05_S-1WR3  [A05_S-1WR3]
U?#43  A05_S-1WR3  [A05_S-1WR3]
U?#44  LM1117IMP  [SOT223_M]
U?#45  A05_S-1WR3  [A05_S-1WR3]
U?#46  A05_S-1WR3  [A05_S-1WR3]
U?#47  F0505XT-W2R3  [F0505XT-W2R3]
U?#48  A05_S-1WR3  [A05_S-1WR3]
U?#49  A05_S-1WR3  [A05_S-1WR3]
U?#50  HCPL063A  [SO-8-N]  (value not drawn)
U?#51  HCPL063A  [SO-8-N]  (value not drawn)
U?#52  HCPL063A  [SO-8-N]  (value not drawn)
U?#53  HCPL063A  [SO-8-N]  (value not drawn)
U?#54  HCPL063A  [SO-8-N]  (value not drawn)

### Ports
3.3VCC (out), 5VDD (out), 5VON (out), 15V1 (out), 15V2 (out), 15V3 (out), 15V4 (out), 15V5 (out), 15V6 (out), 15V7 (out), 15V8 (out), -15V1 (out), -15V2 (out), -15V3 (out), -15V4 (out), -15V5 (out), -15V6 (out), -15V7 (out), -15V8 (out), DGND (out), SGND (out), VIN+ (in), VIN- (in), ±15V1ON (out), ±15V2ON (out), ±15V3ON (out), ±15V4ON (out), ±15V5ON (out), ±15V6ON (out), ±15V7ON (out), ±15V8ON (out), ±15VGND1 (out), ±15VGND2 (out), ±15VGND3 (out), ±15VGND4 (out), ±15VGND5 (out), ±15VGND6 (out), ±15VGND7 (out), ±15VGND8 (out)

### Nets
3.3VCC: C?#191.1 C?#192.1 C?#214.1 C?#215.1 C?#224.1 C?#225.1 C?#226.1 C?#227.1 C?#228.1 C?#229.1 C?#230.1 C?#231.1 R?#102.1 R?#104.1 R?#105.1 R?#106.1 R?#107.1 R?#112.1 R?#113.1 R?#114.1 R?#115.1 U?#44.2(VOUT) U?#50.8(VCC) U?#51.8(VCC) U?#52.8(VCC) U?#53.8(VCC) U?#54.8(VCC) ; port 3.3VCC
5VDD: C?#205.1 C?#209.2 R?#103.2 U?#47.5(VO+) ; port 5VDD
5VIN: C?#168.1 C?#169.1 C?#170.2 C?#172.2 C?#178.1 C?#179.2 C?#182.1 C?#183.1 C?#184.2 C?#186.2 C?#190.1 C?#193.2 C?#198.1 C?#199.1 C?#200.2 C?#202.2 C?#204.1 C?#208.2 C?#216.1 C?#217.1 C?#218.2 C?#220.2 U?#39.1(VIN+) U?#40.1(VIN+) U?#41.5(VO+) U?#42.1(VIN+) U?#43.1(VIN+) U?#44.3(VIN) U?#45.1(VIN+) U?#46.1(VIN+) U?#47.2(VIN+) U?#48.1(VIN+) U?#49.1(VIN+)
5VIN-: C?#168.2 C?#169.2 C?#170.1 C?#172.1 C?#178.2 C?#179.1 C?#182.2 C?#183.2 C?#184.1 C?#186.1 C?#190.2 C?#191.2 C?#192.2 C?#193.1 C?#198.2 C?#199.2 C?#200.1 C?#202.1 C?#204.2 C?#208.1 C?#214.2 C?#215.2 C?#216.2 C?#217.2 C?#218.1 C?#220.1 C?#224.2 C?#225.2 C?#226.2 C?#227.2 C?#228.2 C?#229.2 C?#230.2 C?#231.2 U?#39.2(VIN-) U?#40.2(VIN-) U?#41.7(GND) U?#42.2(VIN-) U?#43.2(VIN-) U?#44.1(ADJ) U?#45.2(VIN-) U?#46.2(VIN-) U?#47.1(VIN-) U?#48.2(VIN-) U?#49.2(VIN-) U?#50.2(CATHODE_1) U?#50.5(GND) U?#51.5(GND) U?#52.5(GND) U?#53.5(GND) U?#54.5(GND) ; port DGND  [also labelled DGND]
15V1: C?#161.1 C?#161.2 C?#162.2 C?#163.1 C?#163.2 C?#164.2 C?#171.2 C?#173.2 C?#174.1 C?#175.1 C?#176.2 C?#177.2 C?#180.2 C?#181.2 C?#185.2 C?#187.2 C?#188.1 C?#189.1 C?#194.2 C?#195.2 C?#196.2 C?#197.2 C?#201.2 C?#203.2 C?#206.1 C?#207.1 C?#210.2 C?#211.2 C?#212.2 C?#213.2 C?#219.2 C?#221.2 C?#222.1 C?#223.1 R?#108.2 U?#39.5(GND) U?#39.6(+VO) U?#40.5(GND) U?#42.5(GND) U?#43.5(GND) U?#45.5(GND) U?#46.5(GND) U?#48.5(GND) U?#49.5(GND) ; port 15V1, port ±15VGND1, port ±15VGND2, port ±15VGND3, port ±15VGND4, port ±15VGND5, port ±15VGND6, port ±15VGND7, port ±15VGND8  [also labelled ±15VGND1]
15V2: C?#162.1 C?#164.1 R?#110.2 U?#40.6(+VO) ; port 15V2
15V3: C?#176.1 C?#180.1 R?#109.2 U?#42.6(+VO) ; port 15V3
15V4: C?#177.1 C?#181.1 R?#111.2 U?#43.6(+VO) ; port 15V4
15V5: C?#194.1 C?#196.1 R?#116.2 U?#45.6(+VO) ; port 15V5
15V6: C?#195.1 C?#197.1 R?#118.2 U?#46.6(+VO) ; port 15V6
15V7: C?#210.1 C?#212.1 R?#117.2 U?#48.6(+VO) ; port 15V7
15V8: C?#211.1 C?#213.1 R?#119.2 U?#49.6(+VO) ; port 15V8
-15V1: C?#171.1 C?#174.2 U?#39.4(-VO) U?#51.2(CATHODE_1) ; port -15V1
-15V2: C?#173.1 C?#175.2 U?#40.4(-VO) U?#51.3(CATHODE_2) ; port -15V2
-15V3: C?#185.1 C?#188.2 U?#42.4(-VO) U?#52.2(CATHODE_1) ; port -15V3
-15V4: C?#187.1 C?#189.2 U?#43.4(-VO) U?#52.3(CATHODE_2) ; port -15V4
-15V5: C?#201.1 C?#206.2 U?#45.4(-VO) U?#53.2(CATHODE_1) ; port -15V5
-15V6: C?#203.1 C?#207.2 U?#46.4(-VO) U?#53.3(CATHODE_2) ; port -15V6
-15V7: C?#219.1 C?#222.2 U?#48.4(-VO) U?#54.2(CATHODE_1) ; port -15V7
-15V8: C?#221.1 C?#223.2 U?#49.4(-VO) U?#54.3(CATHODE_2) ; port -15V8
SGND: C?#205.2 C?#209.1 U?#47.4(GND) ; port SGND
V+: C?#166.1 C?#167.1 L?.2 U?#41.4(VIN+)
VIN+: F?.1 ; port VIN+
VIN-: C?#165.2 C?#166.2 C?#167.2 D?#146.1(A) R?#101.1 U?#41.1(VIN-) ; port VIN-
5VON: R?#102.2 U?#50.7(VO1) ; port 5VON
±15V1ON: R?#104.2 U?#51.7(VO1) ; port ±15V1ON
±15V2ON: R?#105.2 U?#51.6(VO2) ; port ±15V2ON
±15V3ON: R?#106.2 U?#52.7(VO1) ; port ±15V3ON
±15V4ON: R?#107.2 U?#52.6(VO2) ; port ±15V4ON
±15V5ON: R?#112.2 U?#53.7(VO1) ; port ±15V5ON
±15V6ON: R?#113.2 U?#53.6(VO2) ; port ±15V6ON
±15V7ON: R?#114.2 U?#54.7(VO1) ; port ±15V7ON
±15V8ON: R?#115.2 U?#54.6(VO2) ; port ±15V8ON
NetC?#165_1: C?#165.1 D?#146.2(K) L?.1 R?#99.1 R?#100.1
NetD?#145_1: D?#145.1(A) F?.2 R?#101.2
NetD?#145_2: D?#145.2(K) R?#99.2 R?#100.2
NetR?#103_1: R?#103.1 U?#50.1(ANODE_1)
NetR?#108_1: R?#108.1 U?#51.1(ANODE_1)
NetR?#109_1: R?#109.1 U?#52.1(ANODE_1)
NetR?#110_1: R?#110.1 U?#51.4(ANODE_2)
NetR?#111_1: R?#111.1 U?#52.4(ANODE_2)
NetR?#116_1: R?#116.1 U?#53.1(ANODE_1)
NetR?#117_1: R?#117.1 U?#54.1(ANODE_1)
NetR?#118_1: R?#118.1 U?#53.4(ANODE_2)
NetR?#119_1: R?#119.1 U?#54.4(ANODE_2)

Not connected (* = marked no-connect by the designer): U?#39 3(NC); U?#40 3(NC); U?#41 6(NC); U?#42 3(NC); U?#43 3(NC); U?#45 3(NC); U?#46 3(NC); U?#47 8(NC); U?#48 3(NC); U?#49 3(NC); U?#50 3(CATHODE_2) 4(ANODE_2) 6(VO2)

### Notes on the sheet
- 485power
- Title
- Size:
- Date:
- A3
- Number:
- Time:
- Revision:
- Sheet
- of
- File:

### Library data of the parts
C?#161 C?#162 C?#165 C?#166 C?#168 C?#169 C?#174-C?#178 C?#182 C?#183 C?#188-C?#191 C?#194 C?#195 C?#198 C?#199 C?#204-C?#207 C?#210 C?#211 C?#214 C?#216 C?#217 C?#222-C?#225 C?#228 C?#229 = Cap Pol1: Polarized Capacitor (Radial); Published: 8-Jun-2000; LatestRevisionDate: 17-Jul-2002; LatestRevisionNote: Re-released for DXP Platform.; PackageReference: RB7.6-15; Publisher: Altium Limited; PackageDescription: Polarized Capacitor (Radial); 2 Leads
C?#163 C?#164 C?#167 C?#170-C?#173 C?#179-C?#181 C?#184-C?#187 C?#192 C?#193 C?#196 C?#197 C?#200-C?#203 C?#208 C?#209 C?#212 C?#213 C?#215 C?#218-C?#221 C?#226 C?#227 C?#230 C?#231 = Cap: Capacitor; Published: 8-Jun-2000; LatestRevisionDate: 17-Jul-2002; LatestRevisionNote: Re-released for DXP Platform.; PackageReference: RAD-0.3; Publisher: Altium Limited; PackageDescription: Radial Cap, Thru-Hole; 2 Leads; 0.3 in Pin Spacing
D?#145 D?#146 = Diode: Default Diode; Published: 8-Jun-2000; LatestRevisionDate: 17-Jul-2002; LatestRevisionNote: Re-released for DXP Platform.; PackageVersion: Sep-1996; PackageReference: SMC; Publisher: Altium Limited; PackageDescription: DO-214-AB/SMC; 2 C-Bend Leads; Body 7.9 x 5.9 mm, inc. leads (LxW); Code_JEDEC: DO-214-AB
F? = Fuse 1: Fuse; Published: 8-Jun-2000; LatestRevisionDate: 17-Jul-2002; LatestRevisionNote: Re-released for DXP Platform.; PackageReference: PIN-W2/E2.8; Publisher: Altium Limited; PackageDescription: Thru-Hole; 2 Leads
L? = Inductor
R?#99 R?#100 R?#102-R?#119 = Res2: Resistor; Published: 8-Jun-2000; LatestRevisionDate: 17-Jul-2002; LatestRevisionNote: Re-released for DXP Platform.; PackageReference: AXIAL-0.4; Publisher: Altium Limited; PackageDescription: Axial Device, Thru-Hole; 2 Leads; 0.4 in Pin Spacing
R?#101 = Res Varistor: Varistor (Voltage-Sensitive Resistor); Published: 24-Mar-1999; LatestRevisionDate: 29-May-2009; LatestRevisionNote: IPC-7351 Footprint Added.; PackageVersion: Mar-2003; PackageReference: 6-0805; Publisher: Altium Limited; PackageDescription: Chip Resistor 0805 Case Size; Code_IPC: RESC2012

## Sheet mcu.SchDoc: MCU
size A4 portrait; Author: wq; DrawnBy: wq; Organization: Fulei Electronic; Address1: 14a Yulan Rd; Address2: Hefei; Address3: Anhui Pro.; Address4: CHN; DocumentNumber: 1; Revision: betaV1.0; SheetNumber: 1; SheetTotal: 1
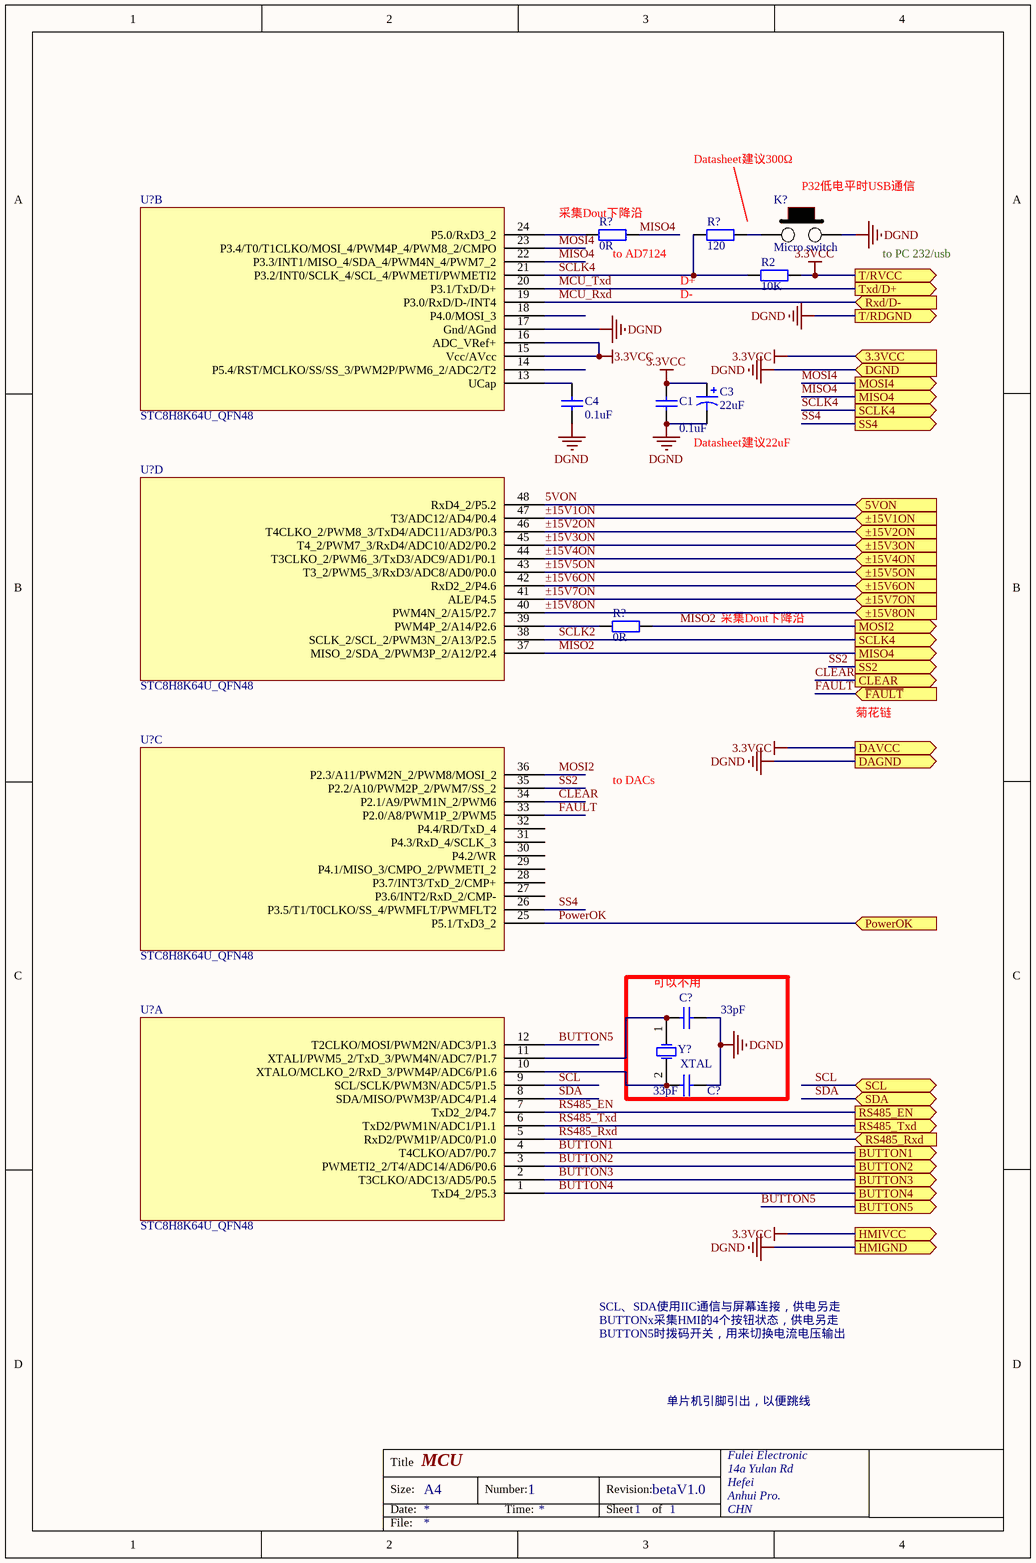
[diagram p16: mcu.SchDoc]

### Parts
(Parts that share a designator on the sheet are numbered #1, #2 ... from top to bottom, then left to right.)
C1#3  value 0.1uF  [0805c]  (hidden comment: CC0805MRX7R9BB104)
C3#3  value 22uF  [CB]  (hidden comment: T494B226M006AHAUTO)
C4#3  value 0.1uF  [0805c]  (hidden comment: CC0805MRX7R9BB104)
C?#232  value 33pF  [0805c]  (hidden comment: CC0805MRX7R9BB330)
C?#233  value 33pF  [0805c]  (hidden comment: CC0805MRX7R9BB330)
K?  Micro switch
R2#3  value 10K  [0805R]  (hidden comment: RC0805JR-0710KL)
R?#120  value 0R  [0805R]  (hidden comment: RC0805JR-000KL)
R?#121  value 120  [0805R]  (hidden comment: RC0805JR-07120RL)
R?#122  value 0R  [0805R]  (hidden comment: RC0805JR-000KL)
U?#55  STC8H8K64U_QFN48  [LQFP48]  (part B of 4)
U?#56  STC8H8K64U_QFN48  [LQFP48]  (part D of 4)
U?#57  STC8H8K64U_QFN48  [LQFP48]  (part C of 4)
U?#58  STC8H8K64U_QFN48  [LQFP48]  (part A of 4)
Y?  XTAL  [11.0592MHz]

### Blocks framed on the sheet
可以不用: C?#232 C?#233 Y?

### Ports
3.3VCC (in), 5VON (in), BUTTON1 (out), BUTTON2 (out), BUTTON3 (out), BUTTON4 (out), BUTTON5 (out), CLEAR (out), DAGND (out), DAVCC (out), DGND (in), HMIGND (out), HMIVCC (out), MISO4 (out), MOSI2 (out), MOSI4 (out), PowerOK (in), RS485_EN (out), RS485_Rxd (in), RS485_Txd (out), Rxd/D- (in), SCL (bidir), SCLK4 (out), SDA (bidir), SS2 (out), SS4 (out), T/RDGND (out), T/RVCC (out), Txd/D+ (out), ~{FAULT} (in), ±15V1ON (in), ±15V2ON (in), ±15V3ON (in), ±15V4ON (in), ±15V5ON (in), ±15V6ON (in), ±15V7ON (in), ±15V8ON (in)

### Nets
3.3VCC: C1#3.1 C3#3.1 R2#3.2 U?#55.15(Vcc/AVcc) U?#55.16(ADC_VRef+) ; port T/RVCC, port 3.3VCC, port DAVCC, port HMIVCC
DGND: C1#3.2 C3#3.2 C4#3.1 C?#232.2 C?#233.2 K?.2 U?#55.17(Gnd/AGnd) ; port T/RDGND, port DGND, port DAGND, port HMIGND  [project net 5VIN-]
5VON: U?#56.48(RxD4_2/P5.2) ; port 5VON
BUTTON1: U?#58.4(T4CLKO/AD7/P0.7) ; port BUTTON1
BUTTON2: U?#58.3(PWMETI2_2/T4/ADC14/AD6/P0.6) ; port BUTTON2
BUTTON3: U?#58.2(T3CLKO/ADC13/AD5/P0.5) ; port BUTTON3
BUTTON4: U?#58.1(TxD4_2/P5.3) ; port BUTTON4
BUTTON5: U?#58.12(T2CLKO/MOSI/PWM2N/ADC3/P1.3) ; port BUTTON5
CLEAR: U?#57.34(P2.1/A9/PWM1N_2/PWM6) ; port CLEAR
FAULT: U?#57.33(P2.0/A8/PWM1P_2/PWM5) ; port ~{FAULT}
MCU_Rxd: U?#55.19(P3.0/RxD/D-/INT4) ; port Rxd/D-
MCU_Txd: U?#55.20(P3.1/TxD/D+) ; port Txd/D+
MISO2: R?#120.2 R?#122.2 U?#55.22(P3.3/INT1/MISO_4/SDA_4/PWM4N_4/PWM7_2) U?#56.37(MISO_2/SDA_2/PWM3P_2/A12/P2.4) ; port MISO4, port MOSI2  [also labelled MISO4]
MOSI2: U?#57.36(P2.3/A11/PWM2N_2/PWM8/MOSI_2)
MOSI4: U?#55.23(P3.4/T0/T1CLKO/MOSI_4/PWM4P_4/PWM8_2/CMPO) ; port MOSI4
PowerOK: U?#57.25(P5.1/TxD3_2) ; port PowerOK
RS485_EN: U?#58.7(TxD2_2/P4.7) ; port RS485_EN
RS485_Rxd: U?#58.5(RxD2/PWM1P/ADC0/P1.0) ; port RS485_Rxd
RS485_Txd: U?#58.6(TxD2/PWM1N/ADC1/P1.1) ; port RS485_Txd
SCL: U?#58.9(SCL/SCLK/PWM3N/ADC5/P1.5) ; port SCL
SCLK2: R2#3.1 R?#121.2 U?#55.21(P3.2/INT0/SCLK_4/SCL_4/PWMETI/PWMETI2) U?#56.38(SCLK_2/SCL_2/PWM3N_2/A13/P2.5) ; port SCLK4  [also labelled SCLK4]
SDA: U?#58.8(SDA/MISO/PWM3P/ADC4/P1.4) ; port SDA
SS2: U?#57.35(P2.2/A10/PWM2P_2/PWM7/SS_2) ; port SS2
SS4: U?#57.26(P3.5/T1/T0CLKO/SS_4/PWMFLT/PWMFLT2) ; port SS4
±15V1ON: U?#56.47(T3/ADC12/AD4/P0.4) ; port ±15V1ON
±15V2ON: U?#56.46(T4CLKO_2/PWM8_3/TxD4/ADC11/AD3/P0.3) ; port ±15V2ON
±15V3ON: U?#56.45(T4_2/PWM7_3/RxD4/ADC10/AD2/P0.2) ; port ±15V3ON
±15V4ON: U?#56.44(T3CLKO_2/PWM6_3/TxD3/ADC9/AD1/P0.1) ; port ±15V4ON
±15V5ON: U?#56.43(T3_2/PWM5_3/RxD3/ADC8/AD0/P0.0) ; port ±15V5ON
±15V6ON: U?#56.42(RxD2_2/P4.6) ; port ±15V6ON
±15V7ON: U?#56.41(ALE/P4.5) ; port ±15V7ON
±15V8ON: U?#56.40(PWM4N_2/A15/P2.7) ; port ±15V8ON
NetC4#3_2: C4#3.2 U?#55.13(UCap)
NetC?#232_1: C?#232.1 U?#58.11(XTALI/PWM5_2/TxD_3/PWM4N/ADC7/P1.7) Y?.1(OSC1)
NetC?#233_1: C?#233.1 U?#58.10(XTALO/MCLKO_2/RxD_3/PWM4P/ADC6/P1.6) Y?.2(OSC2)
NetK?_1: K?.1 R?#121.1
NetR?#120_1: R?#120.1 U?#55.24(P5.0/RxD3_2)
NetR?#122_1: R?#122.1 U?#56.39(PWM4P_2/A14/P2.6)

Not connected (* = marked no-connect by the designer): U?#55 14(P5.4/RST/MCLKO/SS/SS_3/PWM2P/PWM6_2/ADC2/T2) 18(P4.0/MOSI_3); U?#57 27(P3.6/INT2/RxD_2/CMP-) 28(P3.7/INT3/TxD_2/CMP+) 29(P4.1/MISO_3/CMPO_2/PWMETI_2) 30(P4.2/WR) 31(P4.3/RxD_4/SCLK_3) 32(P4.4/RD/TxD_4)

### Notes on the sheet
- Datasheet建议300Ω
- (near R?#120) 采集Dout下降沿
- (near K?) P32低电平时USB通信
- (near R?#120) to AD7124
- (near R?#121) D+
- D-
- to PC 232/usb
- Datasheet建议22uF
- 采集Dout下降沿
- 菊花链
- to DACs
- SCL、SDA使用IIC通信与屏幕连接，供电另走
- BUTTONx采集HMI的4个按钮状态，供电另走
- BUTTON5时拨码开关，用来切换电流电压输出
- 单片机引脚引出，以便跳线
- Title
- Size:
- Date:
- A4
- Number:
- Time:
- Revision:
- Sheet
- of
- File:

### Library data of the parts
C1#3 C4#3 C?#232 C?#233 = Cap: Capacitor
  C?#232 C?#233: Published: 8-Jun-2000; LatestRevisionDate: 17-Jul-2002; LatestRevisionNote: Re-released for DXP Platform.; PackageReference: RAD-0.3; Publisher: Altium Limited; PackageDescription: Radial Cap, Thru-Hole; 2 Leads; 0.3 in Pin Spacing
C3#3 = Cap Pol1: Polarized Capacitor (Radial); Published: 8-Jun-2000; LatestRevisionDate: 17-Jul-2002; LatestRevisionNote: Re-released for DXP Platform.; PackageReference: RB7.6-15; Publisher: Altium Limited; PackageDescription: Polarized Capacitor (Radial); 2 Leads
R2#3 R?#120-R?#122 = Res2: Resistor; Published: 8-Jun-2000; LatestRevisionDate: 17-Jul-2002; LatestRevisionNote: Re-released for DXP Platform.; PackageReference: AXIAL-0.4; Publisher: Altium Limited; PackageDescription: Axial Device, Thru-Hole; 2 Leads; 0.4 in Pin Spacing
Y? = XTAL: Crystal Oscillator; Published: 8-Jun-2000; LatestRevisionDate: 17-Jul-2002; LatestRevisionNote: Re-released for DXP Platform.; PackageReference: R38; Publisher: Altium Limited; PackageDescription: Crystal, Thru-Hole; 2 Leads; Body 3.1 x 8.2 mm (Dia.xH)

## Nets that join several sheets
3.3VCC: betaV1.0 (24 pins), dac (9 pins), relays (24 pins), rs485 (C?#26.1 C?#27.1 U?#11.1), hmi (R?#1.1), power (27 pins), mcu (5 pins)
5VDD: betaV1.0 (25 pins), dac (9 pins), relays (25 pins), rs485 (6 pins), viout (C?#29.1 C?#30.2), power (C?#205.1 C?#209.2 R?#103.2 U?#47.5)
5VIN: betaV1.0 (9 pins), relays (9 pins), power (33 pins)
5VIN-: betaV1.0 (75 pins), dac (12 pins), relays (75 pins), rs485 (C?#26.2 C?#27.2 U?#11.2 U?#11.8), hmi (Q?#1.3), power (51 pins), mcu (7 pins)
15V: betaV1.0 (15 pins), relays (15 pins)
15V1: viout (29 pins), vioutchn1 (40 pins), power (44 pins)
15V2: vioutchn2 (40 pins), power (C?#162.1 C?#164.1 R?#110.2 U?#40.6)
15V3: vioutchn3 (40 pins), power (C?#176.1 C?#180.1 R?#109.2 U?#42.6)
15V4: vioutchn4 (40 pins), power (C?#177.1 C?#181.1 R?#111.2 U?#43.6)
15V5: vioutchn5 (40 pins), power (C?#194.1 C?#196.1 R?#116.2 U?#45.6)
15V6: vioutchn6 (40 pins), power (C?#195.1 C?#197.1 R?#118.2 U?#46.6)
15V7: vioutchn7 (40 pins), power (C?#210.1 C?#212.1 R?#117.2 U?#48.6)
15V8: vioutchn8 (40 pins), power (C?#211.1 C?#213.1 R?#119.2 U?#49.6)
-15V: betaV1.0 (9 pins), relays (9 pins)
-15V1: viout (9 pins), vioutchn1 (9 pins), power (C?#171.1 C?#174.2 U?#39.4 U?#51.2)
-15V2: vioutchn2 (9 pins), power (C?#173.1 C?#175.2 U?#40.4 U?#51.3)
-15V3: vioutchn3 (9 pins), power (C?#185.1 C?#188.2 U?#42.4 U?#52.2)
-15V4: vioutchn4 (9 pins), power (C?#187.1 C?#189.2 U?#43.4 U?#52.3)
-15V5: vioutchn5 (9 pins), power (C?#201.1 C?#206.2 U?#45.4 U?#53.2)
-15V6: vioutchn6 (9 pins), power (C?#203.1 C?#207.2 U?#46.4 U?#53.3)
-15V7: vioutchn7 (9 pins), power (C?#219.1 C?#222.2 U?#48.4 U?#54.2)
-15V8: vioutchn8 (9 pins), power (C?#221.1 C?#223.2 U?#49.4 U?#54.3)
SGND: betaV1.0 (19 pins), dac (12 pins), relays (19 pins), rs485 (7 pins), viout (C?#29.2 C?#30.1), power (C?#205.2 C?#209.1 U?#47.4)
VBIAS: betaV1.0 (R35#1.2 R37#1.1 R72#1.1 U13#1.1), relays (R35#2.2 R37#2.1 R72#2.1 U13#2.1)
VIN+: betaV1.0 (C21#1.1 C24#1.1 L1#1.2 U1#1.4), relays (C21#2.1 C24#2.1 L1#2.2 U1#2.4), power (F?.1)
VIN-: betaV1.0 (7 pins), relays (7 pins), power (6 pins)
VREGF: betaV1.0 (6 pins), dac (21 pins), relays (6 pins)
±15VGND: betaV1.0 (29 pins), dac (21 pins), relays (29 pins)